# Altium schematic sheet US_SB_BIC.SchDoc
size A4
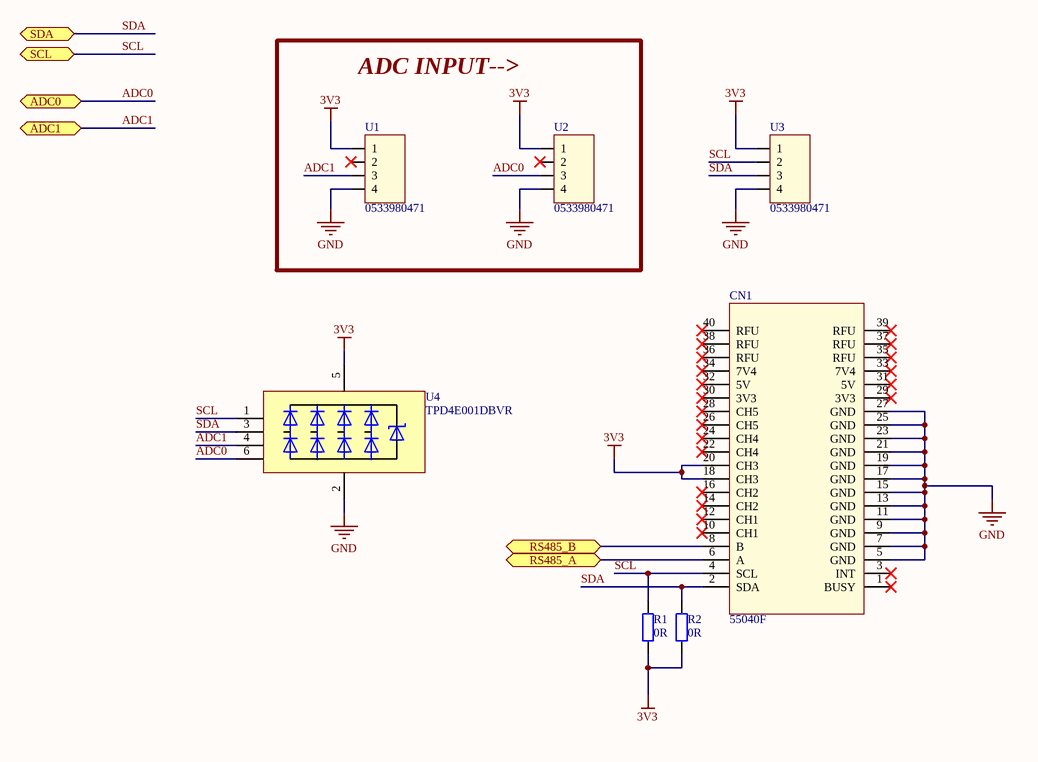
[diagram p0: US_SB_BIC.SchDoc]

## Parts
CN1  55040F  [HEADER_40PIN_12MM2]
R1  0R  [R0603_IPC_MD]  (no BOM)
R2  0R  [R0603_IPC_MD]  (no BOM)
U1  0533980471  [PB_53261-0471_Right]
U2  0533980471  [PB_53261-0471_Right]
U3  0533980471  [PB_53261-0471_Right]
U4  TPD4E001DBVR  [SOT23-6]

## Blocks framed on the sheet
ADC INPUT-->: U1 U2

## Ports
ADC0, ADC1, RS485_A (bidir), RS485_B (bidir), SCL, SDA

## Nets
3V3: CN1.18(CH3) CN1.20(CH3) R1.1 R2.1 U1.1 U2.1 U3.1 U4.5(VCC)
GND: CN1.5(GND) CN1.7(GND) CN1.9(GND) CN1.11(GND) CN1.13(GND) CN1.15(GND) CN1.17(GND) CN1.19(GND) CN1.21(GND) CN1.23(GND) CN1.25(GND) CN1.27(GND) U1.4 U2.4 U3.4 U4.2(GND)
ADC0: U2.3 U4.6(IO4) ; port ADC0
ADC1: U1.3 U4.4(IO3) ; port ADC1
RS485_A: CN1.6(A) ; port RS485_A
RS485_B: CN1.8(B) ; port RS485_B
SCL: CN1.4(SCL) R1.2 U3.2 U4.1(IO1) ; port SCL
SDA: CN1.2(SDA) R2.2 U3.3 U4.3(IO2) ; port SDA

Not connected (* = marked no-connect by the designer): CN1 1(BUSY)* 3(INT)* 10(CH1)* 12(CH1)* 14(CH2)* 16(CH2)* 22(CH4)* 24(CH4)* 26(CH5)* 28(CH5)* 29(3V3)* 30(3V3)* 31(5V)* 32(5V)* 33(7V4)* 34(7V4)* 35(RFU)* 36(RFU)* 37(RFU)* 38(RFU)* 39(RFU)* 40(RFU)*; U1 2*; U2 2*

## Library data of the parts
CN1 = ALFASAT_BIC: CONN HEADER R/A 40POS 2.54MM; Manufacturer: On Shore Technology Inc.; Manufacturer Part Number: 55040F; Supplier 1: LCSC; Supplier Part Number 1: C35165
R1 R2 = CR0603-J/-000ELF: RES SMD 0 OHM JUMPER 1/10W 0603; Manufacturer: Bourns Inc.; Tolarance: 1%; Value: 0R; Manufacturer Part Number: CR0603-J/-000ELF; Supplier 1: Digi-Key; Supplier Part Number 1: CR0603-J/-000ELFCT-ND
U1-U3 = PB_053398_0471: Connector Header Surface Mount 4 position 0.049" (1.25mm); Manufacturer: Molex; Manufacturer Part Number: 0533980471; Supplier 1: Digi-Key; Supplier Part Number 1: WM7608TR-ND
U4 = TPD4E001DBVR: 4x TVS DIODE 5.5V SOT23-6; Manufacturer: TI; Manufacturer Part Number: TPD4E001DBVR; Supplier 1: Digi-Key; Supplier Part Number 1: 296-28203-1-ND